# EAGLE design keybored (EAGLE 8.7.0)
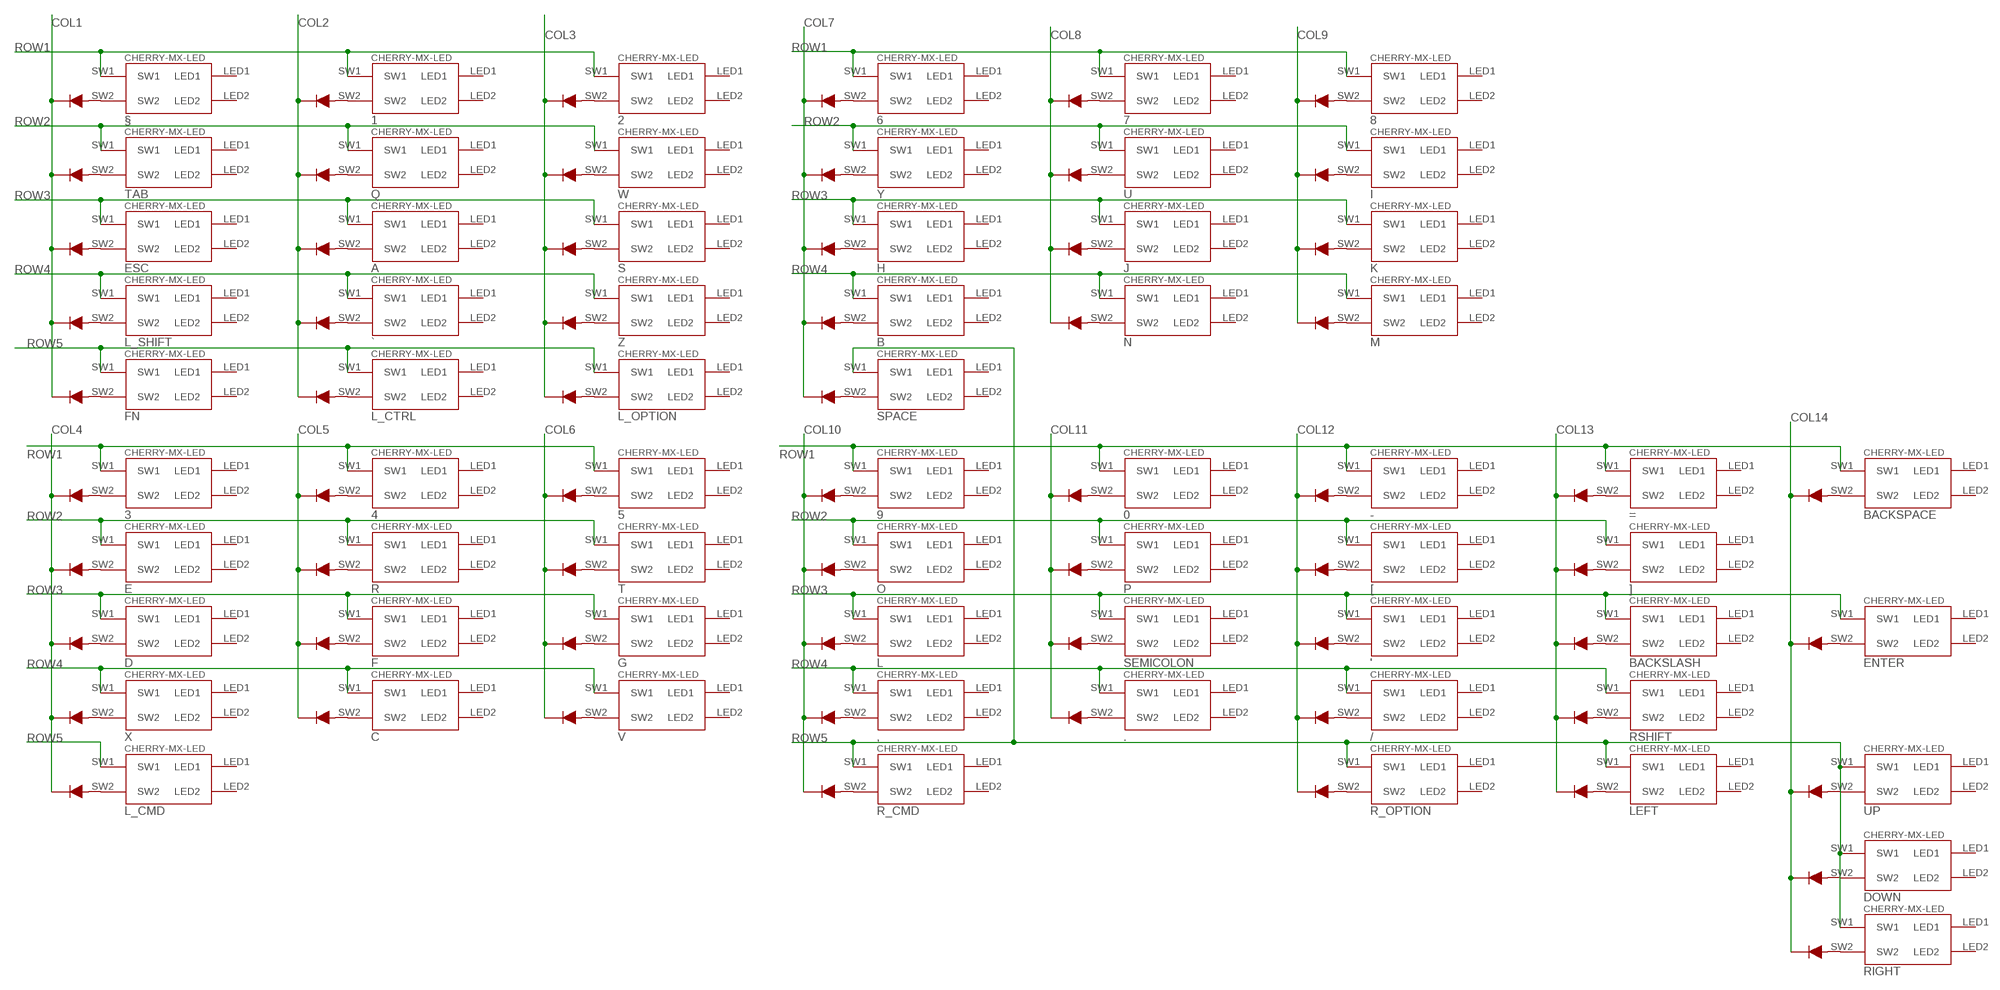
[diagram p0: schematic, sheet 1]

## Parts
0  CHERRY-MX-LED  [CHERRY-MX-LED]
1  CHERRY-MX-LED  [CHERRY-MX-LED]
2  CHERRY-MX-LED  [CHERRY-MX-LED]
3  CHERRY-MX-LED  [CHERRY-MX-LED]
4  CHERRY-MX-LED  [CHERRY-MX-LED]
5  CHERRY-MX-LED  [CHERRY-MX-LED]
6  CHERRY-MX-LED  [CHERRY-MX-LED]
7  CHERRY-MX-LED  [CHERRY-MX-LED]
8  CHERRY-MX-LED  [CHERRY-MX-LED]
9  CHERRY-MX-LED  [CHERRY-MX-LED]
'  CHERRY-MX-LED  [CHERRY-MX-LED]
,  CHERRY-MX-LED  [CHERRY-MX-LED]
-  CHERRY-MX-LED  [CHERRY-MX-LED]
.  CHERRY-MX-LED  [CHERRY-MX-LED]
/  CHERRY-MX-LED  [CHERRY-MX-LED]
=  CHERRY-MX-LED  [CHERRY-MX-LED]
[  CHERRY-MX-LED  [CHERRY-MX-LED]
]  CHERRY-MX-LED  [CHERRY-MX-LED]
`  CHERRY-MX-LED  [CHERRY-MX-LED]
A  CHERRY-MX-LED  [CHERRY-MX-LED]
B  CHERRY-MX-LED  [CHERRY-MX-LED]
BACKSLASH  CHERRY-MX-LED  [CHERRY-MX-LED]
BACKSPACE  CHERRY-MX-LED  [CHERRY-MX-LED]
C  CHERRY-MX-LED  [CHERRY-MX-LED]
D  CHERRY-MX-LED  [CHERRY-MX-LED]
D1  DIODE_1N4148W  [SOD123]
D2  DIODE_1N4148W  [SOD123]
D3  DIODE_1N4148W  [SOD123]
D4  DIODE_1N4148W  [SOD123]
D5  DIODE_1N4148W  [SOD123]
D6  DIODE_1N4148W  [SOD123]
D7  DIODE_1N4148W  [SOD123]
D8  DIODE_1N4148W  [SOD123]
D9  DIODE_1N4148W  [SOD123]
D10  DIODE_1N4148W  [SOD123]
D11  DIODE_1N4148W  [SOD123]
D12  DIODE_1N4148W  [SOD123]
D13  DIODE_1N4148W  [SOD123]
D14  DIODE_1N4148W  [SOD123]
D15  DIODE_1N4148W  [SOD123]
D16  DIODE_1N4148W  [SOD123]
D17  DIODE_1N4148W  [SOD123]
D18  DIODE_1N4148W  [SOD123]
D19  DIODE_1N4148W  [SOD123]
D20  DIODE_1N4148W  [SOD123]
D21  DIODE_1N4148W  [SOD123]
D22  DIODE_1N4148W  [SOD123]
D23  DIODE_1N4148W  [SOD123]
D24  DIODE_1N4148W  [SOD123]
D25  DIODE_1N4148W  [SOD123]
D26  DIODE_1N4148W  [SOD123]
D27  DIODE_1N4148W  [SOD123]
D28  DIODE_1N4148W  [SOD123]
D29  DIODE_1N4148W  [SOD123]
D30  DIODE_1N4148W  [SOD123]
D31  DIODE_1N4148W  [SOD123]
D32  DIODE_1N4148W  [SOD123]
D33  DIODE_1N4148W  [SOD123]
D34  DIODE_1N4148W  [SOD123]
D35  DIODE_1N4148W  [SOD123]
D36  DIODE_1N4148W  [SOD123]
D37  DIODE_1N4148W  [SOD123]
D38  DIODE_1N4148W  [SOD123]
D39  DIODE_1N4148W  [SOD123]
D40  DIODE_1N4148W  [SOD123]
D41  DIODE_1N4148W  [SOD123]
D42  DIODE_1N4148W  [SOD123]
D43  DIODE_1N4148W  [SOD123]
D44  DIODE_1N4148W  [SOD123]
D45  DIODE_1N4148W  [SOD123]
D46  DIODE_1N4148W  [SOD123]
D47  DIODE_1N4148W  [SOD123]
D48  DIODE_1N4148W  [SOD123]
D49  DIODE_1N4148W  [SOD123]
D50  DIODE_1N4148W  [SOD123]
D51  DIODE_1N4148W  [SOD123]
D52  DIODE_1N4148W  [SOD123]
D53  DIODE_1N4148W  [SOD123]
D54  DIODE_1N4148W  [SOD123]
D55  DIODE_1N4148W  [SOD123]
D56  DIODE_1N4148W  [SOD123]
D57  DIODE_1N4148W  [SOD123]
D58  DIODE_1N4148W  [SOD123]
D59  DIODE_1N4148W  [SOD123]
D60  DIODE_1N4148W  [SOD123]
D61  DIODE_1N4148W  [SOD123]
D62  DIODE_1N4148W  [SOD123]
D63  DIODE_1N4148W  [SOD123]
D64  DIODE_1N4148W  [SOD123]
D65  DIODE_1N4148W  [SOD123]
DOWN  CHERRY-MX-LED  [CHERRY-MX-LED]
E  CHERRY-MX-LED  [CHERRY-MX-LED]
ENTER  CHERRY-MX-LED  [CHERRY-MX-LED]
ESC  CHERRY-MX-LED  [CHERRY-MX-LED]
F  CHERRY-MX-LED  [CHERRY-MX-LED]
FN  CHERRY-MX-LED  [CHERRY-MX-LED]
G  CHERRY-MX-LED  [CHERRY-MX-LED]
H  CHERRY-MX-LED  [CHERRY-MX-LED]
I  CHERRY-MX-LED  [CHERRY-MX-LED]
J  CHERRY-MX-LED  [CHERRY-MX-LED]
K  CHERRY-MX-LED  [CHERRY-MX-LED]
L  CHERRY-MX-LED  [CHERRY-MX-LED]
L_CMD  CHERRY-MX-LED  [CHERRY-MX-LED]
L_CTRL  CHERRY-MX-LED  [CHERRY-MX-LED]
L_OPTION  CHERRY-MX-LED  [CHERRY-MX-LED]
L_SHIFT  CHERRY-MX-LED  [CHERRY-MX-LED]
LEFT  CHERRY-MX-LED  [CHERRY-MX-LED]
M  CHERRY-MX-LED  [CHERRY-MX-LED]
N  CHERRY-MX-LED  [CHERRY-MX-LED]
O  CHERRY-MX-LED  [CHERRY-MX-LED]
P  CHERRY-MX-LED  [CHERRY-MX-LED]
Q  CHERRY-MX-LED  [CHERRY-MX-LED]
R  CHERRY-MX-LED  [CHERRY-MX-LED]
R_CMD  CHERRY-MX-LED  [CHERRY-MX-LED]
R_OPTION  CHERRY-MX-LED  [CHERRY-MX-LED]
RIGHT  CHERRY-MX-LED  [CHERRY-MX-LED]
RSHIFT  CHERRY-MX-LED  [CHERRY-MX-LED]
S  CHERRY-MX-LED  [CHERRY-MX-LED]
SEMICOLON  CHERRY-MX-LED  [CHERRY-MX-LED]
SPACE  CHERRY-MX-LED  [CHERRY-MX-LED]
T  CHERRY-MX-LED  [CHERRY-MX-LED]
TAB  CHERRY-MX-LED  [CHERRY-MX-LED]
U  CHERRY-MX-LED  [CHERRY-MX-LED]
UP  CHERRY-MX-LED  [CHERRY-MX-LED]
V  CHERRY-MX-LED  [CHERRY-MX-LED]
W  CHERRY-MX-LED  [CHERRY-MX-LED]
X  CHERRY-MX-LED  [CHERRY-MX-LED]
Y  CHERRY-MX-LED  [CHERRY-MX-LED]
Z  CHERRY-MX-LED  [CHERRY-MX-LED]
§  CHERRY-MX-LED  [CHERRY-MX-LED]

## Nets
COL1: D1.P$2 D7.P$2 D8.P$2 D9.P$2 D10.P$2
COL2: D2.P$2 D3.P$2 D4.P$2 D5.P$2 D6.P$2
COL3: D11.P$2 D12.P$2 D13.P$2 D14.P$2 D15.P$2
COL4: D26.P$2 D27.P$2 D28.P$2 D29.P$2 D30.P$2
COL5: D21.P$2 D22.P$2 D23.P$2 D24.P$2
COL6: D16.P$2 D17.P$2 D18.P$2 D19.P$2
COL7: D25.P$2 D31.P$2 D32.P$2 D33.P$2 D34.P$2
COL8: D37.P$2 D38.P$2 D39.P$2 D40.P$2
COL9: D42.P$2 D43.P$2 D44.P$2 D45.P$2
COL10: D20.P$2 D46.P$2 D47.P$2 D48.P$2 D49.P$2
COL11: D52.P$2 D53.P$2 D54.P$2 D55.P$2
COL12: D35.P$2 D56.P$2 D57.P$2 D58.P$2 D59.P$2
COL13: D36.P$2 D60.P$2 D61.P$2 D62.P$2 D63.P$2
COL14: D41.P$2 D50.P$2 D51.P$2 D64.P$2 D65.P$2
N$6: D1.P$1 §.SW2
N$7: 1.SW2 D2.P$1
N$8: D3.P$1 Q.SW2
N$9: A.SW2 D4.P$1
N$10: `.SW2 D5.P$1
N$11: D6.P$1 L_CTRL.SW2
N$12: D7.P$1 TAB.SW2
N$13: D8.P$1 ESC.SW2
N$14: D9.P$1 L_SHIFT.SW2
N$15: D10.P$1 FN.SW2
N$16: 2.SW2 D11.P$1
N$17: D12.P$1 W.SW2
N$18: D13.P$1 S.SW2
N$19: D14.P$1 Z.SW2
N$20: D15.P$1 L_OPTION.SW2
N$34: 5.SW2 D16.P$1
N$35: D17.P$1 T.SW2
N$36: D18.P$1 G.SW2
N$37: D19.P$1 V.SW2
N$38: D20.P$1 R_CMD.SW2
N$39: 4.SW2 D21.P$1
N$40: D22.P$1 R.SW2
N$41: D23.P$1 F.SW2
N$42: C.SW2 D24.P$1
N$43: D25.P$1 SPACE.SW2
N$44: 3.SW2 D26.P$1
N$45: D27.P$1 E.SW2
N$46: D28.P$1 D.SW2
N$47: D29.P$1 X.SW2
N$48: D30.P$1 L_CMD.SW2
N$57: 6.SW2 D31.P$1
N$58: D32.P$1 Y.SW2
N$59: D33.P$1 H.SW2
N$60: B.SW2 D34.P$1
N$61: D35.P$1 R_OPTION.SW2
N$62: D36.P$1 LEFT.SW2
N$63: D37.P$1 N.SW2
N$64: D38.P$1 J.SW2
N$65: D39.P$1 U.SW2
N$66: 7.SW2 D40.P$1
N$67: D41.P$1 UP.SW2
N$68: D42.P$1 M.SW2
N$69: D43.P$1 K.SW2
N$70: D44.P$1 I.SW2
N$71: 8.SW2 D45.P$1
N$72: 9.SW2 D46.P$1
N$73: D47.P$1 O.SW2
N$74: D48.P$1 L.SW2
N$75: ,.SW2 D49.P$1
N$76: D51.P$1 RIGHT.SW2
N$77: ..SW2 D52.P$1
N$78: D53.P$1 SEMICOLON.SW2
N$79: D54.P$1 P.SW2
N$80: 0.SW2 D55.P$1
N$81: -.SW2 D56.P$1
N$82: [.SW2 D57.P$1
N$83: '.SW2 D58.P$1
N$84: /.SW2 D59.P$1
N$85: D50.P$1 DOWN.SW2
N$86: D60.P$1 RSHIFT.SW2
N$87: BACKSLASH.SW2 D61.P$1
N$88: ].SW2 D62.P$1
N$89: =.SW2 D63.P$1
N$90: BACKSPACE.SW2 D64.P$1
N$91: D65.P$1 ENTER.SW2
ROW1: 0.SW1 1.SW1 2.SW1 3.SW1 4.SW1 5.SW1 6.SW1 7.SW1 8.SW1 9.SW1 -.SW1 =.SW1 BACKSPACE.SW1 §.SW1
ROW2: [.SW1 ].SW1 E.SW1 I.SW1 O.SW1 P.SW1 Q.SW1 R.SW1 T.SW1 TAB.SW1 U.SW1 W.SW1 Y.SW1
ROW3: '.SW1 A.SW1 BACKSLASH.SW1 D.SW1 ENTER.SW1 ESC.SW1 F.SW1 G.SW1 H.SW1 J.SW1 K.SW1 L.SW1 S.SW1 SEMICOLON.SW1
ROW4: ,.SW1 ..SW1 /.SW1 `.SW1 B.SW1 C.SW1 L_SHIFT.SW1 M.SW1 N.SW1 RSHIFT.SW1 V.SW1 X.SW1 Z.SW1
ROW5: DOWN.SW1 FN.SW1 L_CMD.SW1 L_CTRL.SW1 L_OPTION.SW1 LEFT.SW1 R_CMD.SW1 R_OPTION.SW1 RIGHT.SW1 SPACE.SW1 UP.SW1
Unconnected: 0.LED1 0.LED2 1.LED1 1.LED2 2.LED1 2.LED2 3.LED1 3.LED2 4.LED1 4.LED2 5.LED1 5.LED2 6.LED1 6.LED2 7.LED1 7.LED2 8.LED1 8.LED2 9.LED1 9.LED2 '.LED1 '.LED2 ,.LED1 ,.LED2 -.LED1 -.LED2 ..LED1 ..LED2 /.LED1 /.LED2 =.LED1 =.LED2 [.LED1 [.LED2 ].LED1 ].LED2 `.LED1 `.LED2 A.LED1 A.LED2 B.LED1 B.LED2 BACKSLASH.LED1 BACKSLASH.LED2 BACKSPACE.LED1 BACKSPACE.LED2 C.LED1 C.LED2 D.LED1 D.LED2 DOWN.LED1 DOWN.LED2 E.LED1 E.LED2 ENTER.LED1 ENTER.LED2 ESC.LED1 ESC.LED2 F.LED1 F.LED2 FN.LED1 FN.LED2 G.LED1 G.LED2 H.LED1 H.LED2 I.LED1 I.LED2 J.LED1 J.LED2 K.LED1 K.LED2 L.LED1 L.LED2 L_CMD.LED1 L_CMD.LED2 L_CTRL.LED1 L_CTRL.LED2 L_OPTION.LED1 L_OPTION.LED2 L_SHIFT.LED1 L_SHIFT.LED2 LEFT.LED1 LEFT.LED2 M.LED1 M.LED2 N.LED1 N.LED2 O.LED1 O.LED2 P.LED1 P.LED2 Q.LED1 Q.LED2 R.LED1 R.LED2 R_CMD.LED1 R_CMD.LED2 R_OPTION.LED1 R_OPTION.LED2 RIGHT.LED1 RIGHT.LED2 RSHIFT.LED1 RSHIFT.LED2 S.LED1 S.LED2 SEMICOLON.LED1 SEMICOLON.LED2 SPACE.LED1 SPACE.LED2 T.LED1 T.LED2 TAB.LED1 TAB.LED2 U.LED1 U.LED2 UP.LED1 UP.LED2 V.LED1 V.LED2 W.LED1 W.LED2 X.LED1 X.LED2 Y.LED1 Y.LED2 Z.LED1 Z.LED2 §.LED1 §.LED2

## Library data of the parts
0 1-9 ' , - . / = [ ] ` A B BACKSLASH BACKSPACE C D DOWN E ENTER ESC F FN G H I J K L L_CMD L_CTRL L_OPTION L_SHIFT LEFT M N O P Q R R_CMD R_OPTION RIGHT RSHIFT S SEMICOLON SPACE T TAB U UP V W X Y Z § = keybored:CHERRY-MX-LED: Cherry MX series keyswitch with LED
D1-D65 = keybored:DIODE

## Board
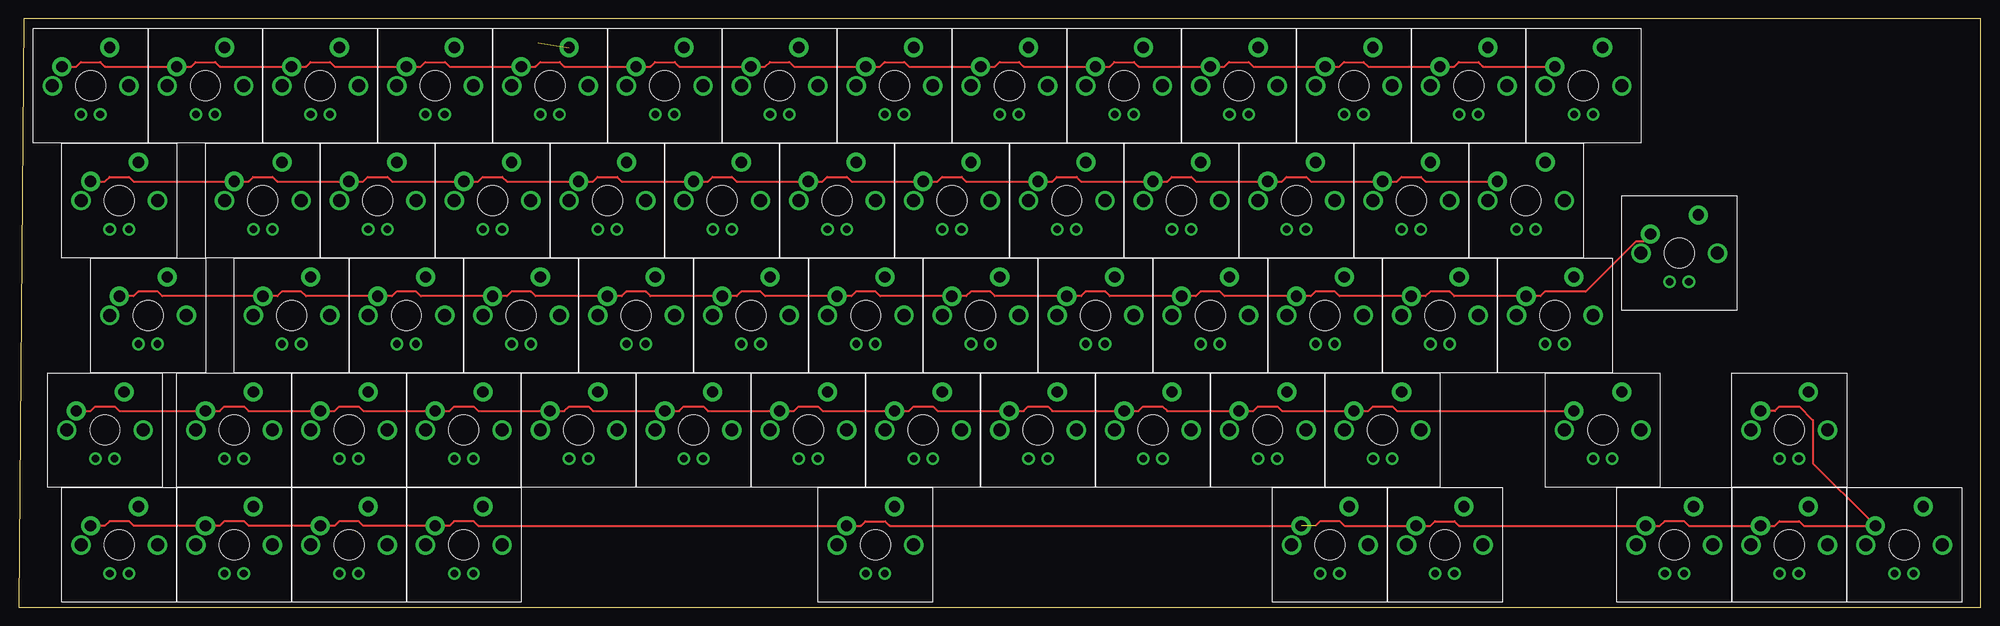
[diagram p1: board, top side]
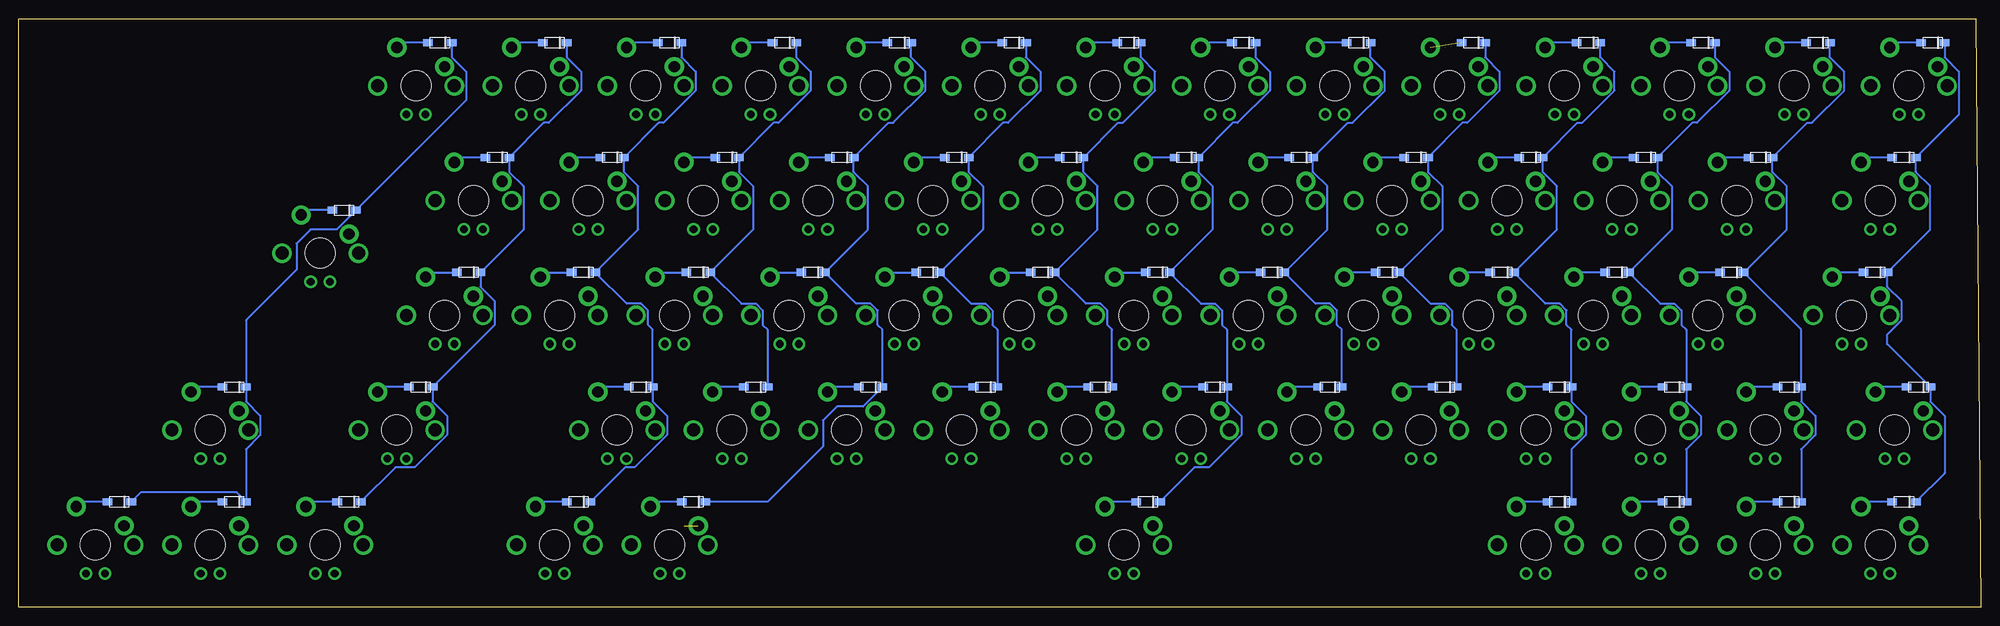
[diagram p2: board, bottom side, seen from below]

Size 260.35 x 78.11 mm. Coordinates in mm from the lower left corner, seen from the top.
Outline: 0,0 260.35,0 260.35,78.11 0.64,78.11 0,0
Copper layers (1*16): Top 0.035mm / dielectric 1.5mm / Bottom 0.035mm
Design rules "default": minimum track width 6mil, minimum drill 0.35mm, track to track 6mil, track to pad 6mil, pad to pad 6mil, via to via 6mil, smd to smd 6mil, copper to edge 40mil, drill to drill 6mil, minimum pad ring 10mil, minimum via ring 8mil, stop-mask expansion 4mil, vias tented up to drill 0mil, thermal gap 10mil

### Footprints (pad centres in the part's own frame; a part is rotated, then mirrored left to right if it is on the bottom)
CHERRY-MX-LED = drill 1.016 pad 1.676: LED1 -1.27,-3.81; LED2 1.27,-3.81 | drill 1.714 pad 1.93: P$3 -5.08,0; P$4 5.08,0 | drill 1.5 pad 2.54: SW1 -3.81,2.54; SW2 2.54,5.08 | hole 4: 0,0
SOD123 = smd 1.27 x 0.95: P$1 -1.575,0; P$2 1.575,0

### Placement (x,y rotation side)
0  161.93,69.22 0 top
1  24.77,69.22 0 top
2  40.01,69.22 0 top
3  55.24,69.22 0 top
4  70.48,69.22 0 top
5  85.72,69.22 0 top
6  100.97,69.22 0 top
7  116.2,69.22 0 top
8  131.44,69.22 0 top
9  146.69,69.22 0 top
'  188.59,38.73 0 top
,  150.5,23.5 0 top
-  177.16,69.22 0 top
.  165.74,23.5 0 top
/  180.97,23.5 0 top
=  192.41,69.22 0 top
[  184.78,53.98 0 top
]  200.03,53.98 0 top
`  28.57,23.5 0 top
A  36.2,38.73 0 top
B  104.78,23.5 0 top
BACKSLASH  203.84,38.73 0 top
BACKSPACE  207.65,69.22 0 top
C  74.3,23.5 0 top
D  66.67,38.73 0 top
D1  6.35,74.93 0 bottom
D2  21.59,74.93 0 bottom
D3  29.21,59.69 0 bottom
D4  33.02,44.45 0 bottom
D5  25.4,29.21 0 bottom
D6  25.4,13.97 0 bottom
D7  10.16,59.69 0 bottom
D8  13.97,44.45 0 bottom
D9  8.26,29.21 0 bottom
D10  10.16,13.97 0 bottom
D11  36.83,74.93 0 bottom
D12  44.45,59.69 0 bottom
D13  48.26,44.45 0 bottom
D14  40.64,29.21 0 bottom
D15  40.64,13.97 0 bottom
D16  82.55,74.93 0 bottom
D17  90.17,59.69 0 bottom
D18  93.98,44.45 0 bottom
D19  86.36,29.21 0 bottom
D20  170.81,13.97 0 bottom
D21  67.31,74.93 0 bottom
D22  74.93,59.69 0 bottom
D23  78.74,44.45 0 bottom
D24  71.12,29.21 0 bottom
D25  110.49,13.97 0 bottom
D26  52.07,74.93 0 bottom
D27  59.69,59.69 0 bottom
D28  63.5,44.45 0 bottom
D29  55.88,29.21 0 bottom
D30  55.88,13.97 0 bottom
D31  97.79,74.93 0 bottom
D32  105.41,59.69 0 bottom
D33  109.22,44.45 0 bottom
D34  101.6,29.21 0 bottom
D35  186.06,13.97 0 bottom
D36  216.53,13.97 0 bottom
D37  116.84,29.21 0 bottom
D38  124.46,44.45 0 bottom
D39  120.65,59.69 0 bottom
D40  113.03,74.93 0 bottom
D41  231.78,29.21 0 bottom
D42  132.08,29.21 0 bottom
D43  139.7,44.45 0 bottom
D44  135.89,59.69 0 bottom
D45  128.27,74.93 0 bottom
D46  143.51,74.93 0 bottom
D47  151.13,59.69 0 bottom
D48  154.94,44.45 0 bottom
D49  147.32,29.21 0 bottom
D50  231.78,13.97 0 bottom
D51  247.01,13.97 0 bottom
D52  162.56,29.21 0 bottom
D53  170.18,44.45 0 bottom
D54  166.37,59.69 0 bottom
D55  158.75,74.93 0 bottom
D56  173.99,74.93 0 bottom
D57  181.61,59.69 0 bottom
D58  185.42,44.45 0 bottom
D59  177.8,29.21 0 bottom
D60  207.01,29.21 0 bottom
D61  200.66,44.45 0 bottom
D62  196.85,59.69 0 bottom
D63  189.23,74.93 0 bottom
D64  204.47,74.93 0 bottom
D65  217.17,52.7 0 bottom
DOWN  234.95,8.26 0 top
E  62.87,53.98 0 top
ENTER  220.34,46.99 0 top
ESC  17.14,38.73 0 top
F  81.92,38.73 0 top
FN  13.34,8.26 0 top
G  97.16,38.73 0 top
H  112.39,38.73 0 top
I  139.06,53.98 0 top
J  127.64,38.73 0 top
K  142.88,38.73 0 top
L  158.12,38.73 0 top
L_CMD  59.05,8.26 0 top
L_CTRL  28.57,8.26 0 top
L_OPTION  43.81,8.26 0 top
L_SHIFT  11.43,23.5 0 top
LEFT  219.71,8.26 0 top
M  135.25,23.5 0 top
N  120.02,23.5 0 top
O  154.31,53.98 0 top
P  169.54,53.98 0 top
Q  32.38,53.98 0 top
R  78.11,53.98 0 top
R_CMD  173.99,8.26 0 top
R_OPTION  189.23,8.26 0 top
RIGHT  250.19,8.26 0 top
RSHIFT  210.19,23.5 0 top
S  51.44,38.73 0 top
SEMICOLON  173.35,38.73 0 top
SPACE  113.67,8.26 0 top
T  93.34,53.98 0 top
TAB  13.34,53.98 0 top
U  123.83,53.98 0 top
UP  234.95,23.5 0 top
V  89.53,23.5 0 top
W  47.62,53.98 0 top
X  59.05,23.5 0 top
Y  108.58,53.98 0 top
Z  43.81,23.5 0 top
§  9.53,69.22 0 top

### Tracks (layer width: path | path; a pad name or v marks a point on that pad's centre or on a via)
COL1
  Bottom 0.254: D10.P$2 4.79,17.77 4.79,25.39 6.68,27.29 D9.P$2 12.39,34.92 12.39,36.19 10.5,38.09 10.5,40.63 12.39,42.53 D8.P$2 6.69,50.16 6.69,55.87 8.59,57.77 D7.P$2 2.88,65.39 2.88,71.11 4.78,73.01 D1.P$2
COL2
  Bottom 0.254: D2.P$2 20.02,73.01 18.12,71.11 18.12,68.57 22.4,64.29 23.04,64.29 D3.P$2 27.64,57.77 25.74,55.87 25.74,50.16 D4.P$2 23.82,36.83 D5.P$2 23.82,27.29 21.93,25.39 21.93,22.85 23.82,20.95 D6.P$2
COL3
  Bottom 0.254: D11.P$2 35.26,73.01 33.36,71.11 33.36,68.57 37.64,64.29 38.28,64.29 D12.P$2 42.88,57.77 40.98,55.87 40.98,50.16 D13.P$2 42.53,40.3 40.63,40.3 39.71,39.38 39.71,37.48 39.06,36.83 D14.P$2 39.06,27.29 37.17,25.39 37.17,22.85 39.06,20.95 D15.P$2
COL4
  Bottom 0.254: D26.P$2 50.49,73.01 48.6,71.11 48.6,68.57 52.88,64.29 53.52,64.29 D27.P$2 58.12,57.77 56.22,55.87 56.22,50.16 D28.P$2 57.77,40.3 55.87,40.3 54.95,39.38 54.95,37.48 54.3,36.83 D29.P$2 54.3,27.29 52.41,25.39 52.41,22.85 54.3,20.95 D30.P$2
COL5
  Bottom 0.254: D21.P$2 65.73,73.01 63.84,71.11 63.84,68.57 68.12,64.29 68.76,64.29 D22.P$2 73.36,57.77 71.46,55.87 71.46,50.16 D23.P$2 73.02,40.3 71.11,40.3 70.19,39.38 70.19,37.48 69.55,36.83 D24.P$2
COL6
  Bottom 0.254: D19.P$2 84.78,36.83 85.43,37.48 85.43,39.38 86.35,40.3 88.25,40.3 D18.P$2 86.7,50.16 86.7,55.87 88.59,57.77 D17.P$2 84,64.29 83.36,64.29 79.08,68.57 79.08,71.11 80.97,73.01 D16.P$2
COL7
  Bottom 0.254: D31.P$2 96.22,73.01 94.32,71.11 94.32,68.57 98.6,64.29 99.24,64.29 D32.P$2 103.83,57.77 101.94,55.87 101.94,50.16 D33.P$2 103.5,40.3 101.59,40.3 100.67,39.38 100.67,37.48 100.03,36.83 D34.P$2 100.03,27.29 98.13,25.39 98.13,22.85 102.41,18.57 104.32,18.57 D25.P$2
COL8
  Bottom 0.254: D37.P$2 115.27,36.83 115.91,37.48 115.91,39.38 116.83,40.3 118.73,40.3 D38.P$2 117.18,50.16 117.18,55.87 119.08,57.77 D39.P$2 114.48,64.29 113.84,64.29 109.56,68.57 109.56,71.11 111.45,73.01 D40.P$2
COL9
  Bottom 0.254: D45.P$2 126.69,73.01 124.8,71.11 124.8,68.57 129.08,64.29 129.72,64.29 D44.P$2 134.31,57.77 132.42,55.87 132.42,50.16 D43.P$2 133.97,40.3 132.07,40.3 131.15,39.38 131.15,37.48 130.5,36.83 D42.P$2
COL10
  Bottom 0.254: D46.P$2 141.94,73.01 140.04,71.11 140.04,68.57 144.32,64.29 144.96,64.29 D47.P$2 149.56,57.77 147.66,55.87 147.66,50.16 D48.P$2 149.22,40.3 147.31,40.3 146.39,39.38 146.39,37.48 145.75,36.83 D49.P$2 148.32,26.64 151.8,26.64 153.64,24.8 153.64,21.32 160.99,13.97 D20.P$2
COL11
  Bottom 0.254: D55.P$2 157.18,73.01 155.28,71.11 155.28,68.57 159.56,64.29 160.2,64.29 D54.P$2 164.79,57.77 162.9,55.87 162.9,50.16 D53.P$2 164.46,40.3 162.55,40.3 161.63,39.38 161.63,37.48 160.99,36.83 D52.P$2
COL12
  Bottom 0.254: D56.P$2 172.41,73.01 170.52,71.11 170.52,68.57 174.8,64.29 175.44,64.29 D57.P$2 180.03,57.77 178.14,55.87 178.14,50.16 D58.P$2 179.69,40.3 177.79,40.3 176.87,39.38 176.87,37.48 176.22,36.83 D59.P$2 176.22,27.29 174.33,25.39 174.33,22.85 178.61,18.57 179.88,18.57 D35.P$2
COL13
  Bottom 0.254: D63.P$2 187.66,73.01 185.76,71.11 185.76,68.57 190.04,64.29 190.68,64.29 D62.P$2 195.28,57.77 193.38,55.87 193.38,50.16 D61.P$2 199.09,42.53 197.19,40.63 197.19,37.45 D60.P$2 205.44,27.29 203.54,25.39 203.54,22.85 207.82,18.57 210.36,18.57 D36.P$2
COL14
  Bottom 0.254: D64.P$2 202.9,73.01 201,71.11 201,67.3 D65.P$2 218.17,50.13 221.65,50.13 223.49,48.29 223.49,44.81 230.2,38.1 D41.P$2 230.2,27.29 228.31,25.39 228.31,22.85 230.2,20.95 D50.P$2 231.47,15.24 244.17,15.24 D51.P$2
N$6
  Bottom 0.254: D1.P$1 11.43,74.93 §.SW2
N$7
  Bottom 0.254: D2.P$1 26.67,74.93 1.SW2
N$8
  Bottom 0.254: D3.P$1 34.29,59.69 Q.SW2
N$9
  Bottom 0.254: D4.P$1 38.1,44.45 A.SW2
N$10
  Bottom 0.254: D5.P$1 30.48,29.21 `.SW2
N$11
  Bottom 0.254: D6.P$1 30.48,13.97 L_CTRL.SW2
N$12
  Bottom 0.254: D7.P$1 15.24,59.69 TAB.SW2
N$13
  Bottom 0.254: D8.P$1 19.05,44.45 ESC.SW2
N$14
  Bottom 0.254: D9.P$1 13.34,29.21 L_SHIFT.SW2
N$15
  Bottom 0.254: D10.P$1 15.24,13.97 FN.SW2
N$16
  Bottom 0.254: D11.P$1 41.91,74.93 2.SW2
N$17
  Bottom 0.254: D12.P$1 49.53,59.69 W.SW2
N$18
  Bottom 0.254: D13.P$1 53.34,44.45 S.SW2
N$19
  Bottom 0.254: D14.P$1 45.72,29.21 Z.SW2
N$20
  Bottom 0.254: D15.P$1 45.72,13.97 L_OPTION.SW2
N$34
  Bottom 0.254: D16.P$1 87.63,74.93 5.SW2
N$35
  Bottom 0.254: D17.P$1 95.25,59.69 T.SW2
N$36
  Bottom 0.254: D18.P$1 99.06,44.45 G.SW2
N$37
  Bottom 0.254: D19.P$1 91.44,29.21 V.SW2
N$38
  Bottom 0.254: D20.P$1 175.9,13.97 R_CMD.SW2
N$39  (1 unrouted)
N$40
  Bottom 0.254: D22.P$1 80.01,59.69 R.SW2
N$41
  Bottom 0.254: D23.P$1 83.82,44.45 F.SW2
N$42
  Bottom 0.254: D24.P$1 76.2,29.21 C.SW2
N$43
  Bottom 0.254: D25.P$1 115.57,13.97 SPACE.SW2
N$44
  Bottom 0.254: D26.P$1 57.15,74.93 3.SW2
N$45
  Bottom 0.254: D27.P$1 64.77,59.69 E.SW2
N$46
  Bottom 0.254: D28.P$1 68.58,44.45 D.SW2
N$47
  Bottom 0.254: D29.P$1 60.96,29.21 X.SW2
N$48
  Bottom 0.254: D30.P$1 60.96,13.97 L_CMD.SW2
N$57
  Bottom 0.254: D31.P$1 102.87,74.93 6.SW2
N$58
  Bottom 0.254: D32.P$1 110.49,59.69 Y.SW2
N$59
  Bottom 0.254: H.SW2 114.3,44.45 D33.P$1
N$60
  Bottom 0.254: D34.P$1 106.68,29.21 B.SW2
N$61
  Bottom 0.254: D35.P$1 191.13,13.97 R_OPTION.SW2
N$62
  Bottom 0.254: D36.P$1 221.62,13.97 LEFT.SW2
N$63
  Bottom 0.254: D37.P$1 121.92,29.21 N.SW2
N$64
  Bottom 0.254: J.SW2 129.54,44.45 D38.P$1
N$65
  Bottom 0.254: D39.P$1 125.73,59.69 U.SW2
N$66
  Bottom 0.254: D40.P$1 118.11,74.93 7.SW2
N$67
  Bottom 0.254: D41.P$1 236.85,29.21 UP.SW2
N$68
  Bottom 0.254: D42.P$1 137.16,29.21 M.SW2
N$69
  Bottom 0.254: K.SW2 144.78,44.45 D43.P$1
N$70
  Bottom 0.254: D44.P$1 140.97,59.69 I.SW2
N$71
  Bottom 0.254: D45.P$1 133.35,74.93 8.SW2
N$72
  Bottom 0.254: D46.P$1 148.59,74.93 9.SW2
N$73
  Bottom 0.254: D47.P$1 156.21,59.69 O.SW2
N$74
  Bottom 0.254: L.SW2 160.02,44.45 D48.P$1
N$75
  Bottom 0.254: D49.P$1 152.4,29.21 ,.SW2
N$76
  Bottom 0.254: D51.P$1 252.09,13.97 RIGHT.SW2
N$77
  Bottom 0.254: D52.P$1 167.64,29.21 ..SW2
N$78
  Bottom 0.254: SEMICOLON.SW2 175.26,44.45 D53.P$1
N$79
  Bottom 0.254: D54.P$1 171.45,59.69 P.SW2
N$80
  Bottom 0.254: D55.P$1 163.83,74.93 0.SW2
N$81
  Bottom 0.254: D56.P$1 179.07,74.93 -.SW2
N$82
  Bottom 0.254: D57.P$1 186.69,59.69 [.SW2
N$83
  Bottom 0.254: '.SW2 190.5,44.45 D58.P$1
N$84
  Bottom 0.254: D59.P$1 182.88,29.21 /.SW2
N$85
  Bottom 0.254: D50.P$1 236.85,13.97 DOWN.SW2
N$86
  Bottom 0.254: D60.P$1 212.09,29.21 RSHIFT.SW2
N$87
  Bottom 0.254: BACKSLASH.SW2 205.74,44.45 D61.P$1
N$88
  Bottom 0.254: D62.P$1 201.93,59.69 ].SW2
N$89
  Bottom 0.254: D63.P$1 194.31,74.93 =.SW2
N$90
  Bottom 0.254: D64.P$1 209.55,74.93 BACKSPACE.SW2
N$91
  Bottom 0.254: D65.P$1 222.25,52.7 ENTER.SW2
ROW1
  Top 0.254: §.SW1 7.62,71.75 8.22,72.36 10.83,72.36 11.43,71.75 1.SW1 22.86,71.75 23.46,72.36 26.07,72.36 26.67,71.75 2.SW1 38.1,71.75 38.7,72.36 41.31,72.36 41.91,71.75 3.SW1 53.34,71.75 53.94,72.36 56.55,72.36 57.15,71.75 4.SW1 68.58,71.75 69.18,72.36 71.79,72.36 72.39,71.75 5.SW1 83.82,71.75 84.42,72.36 87.03,72.36 87.63,71.75 6.SW1 99.06,71.75 99.66,72.36 102.27,72.36 102.87,71.75 7.SW1 114.3,71.75 114.9,72.36 117.51,72.36 118.11,71.75 8.SW1 129.54,71.75 130.14,72.36 132.75,72.36 133.35,71.75 9.SW1 144.78,71.75 145.38,72.36 147.99,72.36 148.59,71.75 0.SW1 160.02,71.75 160.62,72.36 163.23,72.36 163.83,71.75 -.SW1 175.26,71.75 175.86,72.36 178.47,72.36 179.07,71.75 =.SW1 190.5,71.75 191.1,72.36 193.71,72.36 194.31,71.75 BACKSPACE.SW1
ROW2
  Top 0.254: TAB.SW1 11.43,56.52 12.03,57.12 14.64,57.12 15.24,56.52 Q.SW1 30.48,56.52 31.08,57.12 33.69,57.12 34.29,56.52 W.SW1 45.72,56.52 46.32,57.12 48.93,57.12 49.53,56.52 E.SW1 60.96,56.52 61.56,57.12 64.17,57.12 64.77,56.52 R.SW1 76.2,56.52 76.8,57.12 79.41,57.12 80.01,56.52 T.SW1 91.44,56.52 92.04,57.12 94.65,57.12 95.25,56.52 Y.SW1 106.68,56.52 107.28,57.12 109.89,57.12 110.49,56.52 U.SW1 121.92,56.52 122.52,57.12 125.13,57.12 125.73,56.52 I.SW1 137.16,56.52 137.76,57.12 140.37,57.12 140.97,56.52 O.SW1 152.4,56.52 153,57.12 155.61,57.12 156.21,56.52 P.SW1 167.64,56.52 168.24,57.12 170.85,57.12 171.45,56.52 [.SW1 182.88,56.52 183.48,57.12 186.09,57.12 186.69,56.52 ].SW1
ROW3
  Top 0.254: ENTER.SW1 215.56,48.55 214.62,48.55 207.94,41.88 202.53,41.88 201.93,41.27 BACKSLASH.SW1 190.5,41.27 189.9,41.88 187.29,41.88 186.69,41.27 '.SW1 175.26,41.27 174.66,41.88 172.05,41.88 171.45,41.27 SEMICOLON.SW1 160.02,41.27 159.42,41.88 156.81,41.88 156.21,41.27 L.SW1 144.78,41.27 144.18,41.88 141.57,41.88 140.97,41.27 K.SW1 129.54,41.27 128.94,41.88 126.33,41.88 125.73,41.27 J.SW1 114.3,41.27 113.7,41.88 111.09,41.88 110.49,41.27 H.SW1 99.06,41.27 98.46,41.88 95.85,41.88 95.25,41.27 G.SW1 83.82,41.27 83.22,41.88 80.61,41.88 80.01,41.27 F.SW1 68.58,41.27 67.98,41.88 65.37,41.88 64.77,41.27 D.SW1 53.34,41.27 52.74,41.88 50.13,41.88 49.53,41.27 S.SW1 38.1,41.27 37.5,41.88 34.89,41.88 34.29,41.27 A.SW1 19.05,41.27 18.45,41.88 15.84,41.88 15.24,41.27 ESC.SW1
ROW4
  Top 0.254: L_SHIFT.SW1 9.53,26.04 10.13,26.64 12.73,26.64 13.34,26.04 `.SW1 26.67,26.04 27.27,26.64 29.88,26.64 30.48,26.04 Z.SW1 41.91,26.04 42.51,26.64 45.12,26.64 45.72,26.04 X.SW1 57.15,26.04 57.75,26.64 60.36,26.64 60.96,26.04 C.SW1 72.39,26.04 72.99,26.64 75.6,26.64 76.2,26.04 V.SW1 87.63,26.04 88.23,26.64 90.84,26.64 91.44,26.04 B.SW1 102.87,26.04 103.47,26.64 106.08,26.64 106.68,26.04 N.SW1 118.11,26.04 118.71,26.64 121.32,26.64 121.92,26.04 M.SW1 133.35,26.04 133.95,26.64 136.56,26.64 137.16,26.04 ,.SW1 148.59,26.04 149.19,26.64 151.8,26.64 152.4,26.04 ..SW1 163.83,26.04 164.43,26.64 167.04,26.64 167.64,26.04 /.SW1 179.07,26.04 179.67,26.64 182.28,26.64 182.88,26.04 RSHIFT.SW1
ROW5  (1 unrouted)
  Top 0.254: 172.09,10.79 172.69,11.4 175.29,11.4 175.9,10.79 R_OPTION.SW1 187.32,10.79 187.93,11.4 190.53,11.4 191.13,10.79 LEFT.SW1 217.81,10.79 218.41,11.4 221.01,11.4 221.62,10.79 DOWN.SW1 233.04,10.79 233.65,11.4 236.25,11.4 236.85,10.79 245.75,10.79 | UP.SW1 233.04,26.04 233.65,26.64 236.25,26.64 238.09,24.8 238.09,19.08 245.75,11.43 245.75,10.79 | 245.75,10.79 RIGHT.SW1 | R_CMD.SW1 115.57,10.79 114.97,11.4 112.36,11.4 111.76,10.79 SPACE.SW1 60.96,10.79 60.36,11.4 57.75,11.4 57.15,10.79 L_CMD.SW1 45.72,10.79 45.12,11.4 42.51,11.4 41.91,10.79 L_OPTION.SW1 30.48,10.79 29.88,11.4 27.27,11.4 26.67,10.79 L_CTRL.SW1 15.24,10.79 14.64,11.4 12.03,11.4 11.43,10.79 FN.SW1